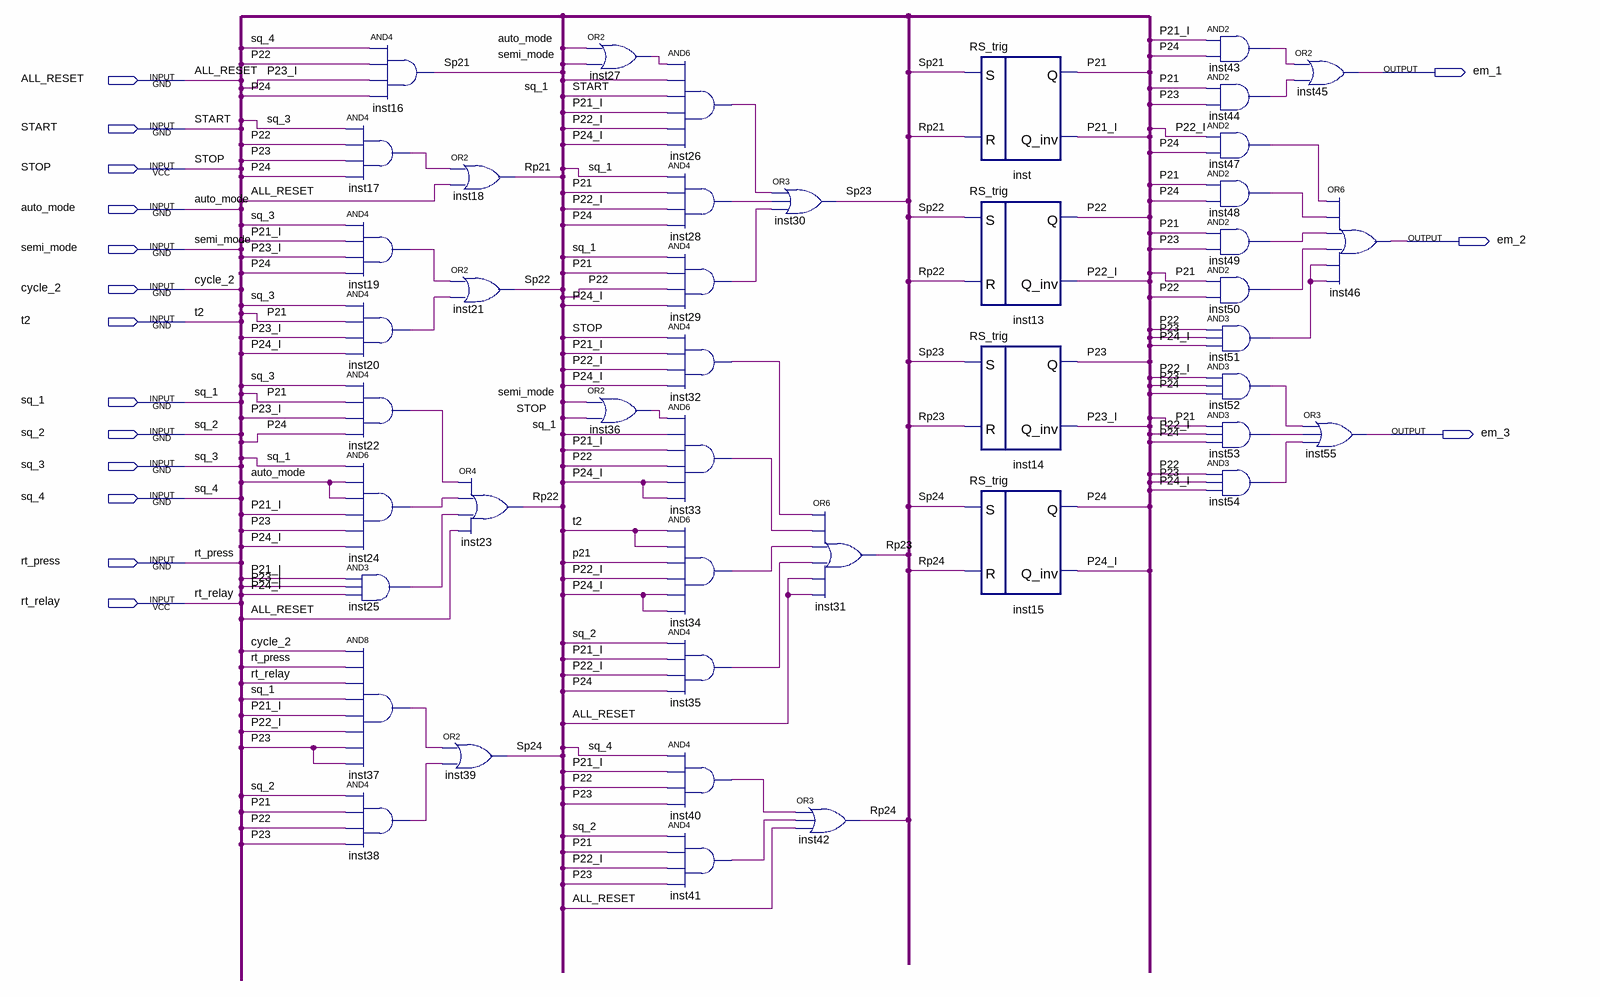
[diagram p0: schematic sheet]
// Quartus schematic cycle_2.bdf as structural Verilog: 44 symbols, 16 pins
module cycle_2 (
  input  ALL_RESET,
  input  START,
  input  STOP,
  input  auto_mode,
  input  semi_mode,
  input  cycle_2,
  input  t2,
  input  sq_1,
  input  sq_2,
  input  sq_3,
  input  sq_4,
  input  rt_press,
  input  rt_relay,
  output em_1,
  output em_2,
  output em_3
);

  wire inst17_out, inst19_out, inst20_out, inst22_out, inst24_out, inst25_out, inst26_out, inst27_out,
       inst28_out, inst29_out, inst32_out, inst33_out, inst34_out, inst35_out, inst36_out, inst37_out,
       inst38_out, inst40_out, inst41_out, inst43_out, inst44_out, inst47_out, inst48_out, inst49_out,
       inst50_out, inst51_out, inst52_out, inst53_out, inst54_out, P21, P21_I, P22, P22_I, P23, P23_I, P24,
       P24_I, Rp21, Rp22, Rp23, Rp24, Sp21, Sp22, Sp23, Sp24;

  and inst16 (Sp21, sq_4, P22, P23_I, P24);
  and inst17 (inst17_out, sq_3, P22, P23, P24);
  and inst19 (inst19_out, sq_3, P21_I, P23_I, P24);
  and inst20 (inst20_out, sq_3, P21, P23_I, P24_I);
  and inst22 (inst22_out, sq_3, P21, P23_I, P24);
  and inst24 (inst24_out, sq_1, auto_mode, auto_mode, P21_I, P23, P24_I);
  and inst25 (inst25_out, P21_I, P23_I, P24_I);
  and inst37 (inst37_out, cycle_2, rt_press, rt_relay, sq_1, P21_I, P22_I, P23, P23);
  and inst38 (inst38_out, sq_2, P21, P22, P23);
  or inst18 (Rp21, inst17_out, ALL_RESET);
  or inst21 (Sp22, inst19_out, inst20_out);
  or inst23 (Rp22, inst22_out, inst24_out, inst25_out, ALL_RESET);
  or inst39 (Sp24, inst37_out, inst38_out);
  or inst27 (inst27_out, auto_mode, semi_mode);
  or inst36 (inst36_out, semi_mode, STOP);
  and inst26 (inst26_out, inst27_out, sq_1, START, P21_I, P22_I, P24_I);
  and inst28 (inst28_out, sq_1, P21, P22_I, P24);
  and inst29 (inst29_out, sq_1, P21, P22, P24_I);
  and inst32 (inst32_out, STOP, P21_I, P22_I, P24_I);
  and inst33 (inst33_out, inst36_out, sq_1, P21_I, P22, P24_I, P24_I);
  and inst34 (inst34_out, t2, t2, P21, P22_I, P24_I, P24_I);
  and inst35 (inst35_out, sq_2, P21_I, P22_I, P24);
  and inst40 (inst40_out, sq_4, P21_I, P22, P23);
  and inst41 (inst41_out, sq_2, P21, P22_I, P23);
  or inst30 (Sp23, inst26_out, inst28_out, inst29_out);
  or inst31 (Rp23, inst32_out, inst33_out, inst34_out, inst35_out, ALL_RESET, ALL_RESET);
  or inst42 (Rp24, inst40_out, inst41_out, ALL_RESET);
  RS_trig inst (.S(Sp21), .R(Rp21), .Q(P21), .Q_inv(P21_I));
  RS_trig inst13 (.S(Sp22), .R(Rp22), .Q(P22), .Q_inv(P22_I));
  RS_trig inst14 (.S(Sp23), .R(Rp23), .Q(P23), .Q_inv(P23_I));
  RS_trig inst15 (.S(Sp24), .R(Rp24), .Q(P24), .Q_inv(P24_I));
  and inst43 (inst43_out, P21_I, P24);
  and inst44 (inst44_out, P21, P23);
  and inst47 (inst47_out, P22_I, P24);
  and inst48 (inst48_out, P21, P24);
  and inst49 (inst49_out, P21, P23);
  and inst50 (inst50_out, P21, P22);
  and inst51 (inst51_out, P22, P23, P24_I);
  and inst52 (inst52_out, P22_I, P23, P24);
  and inst53 (inst53_out, P21, P22_I, P24);
  and inst54 (inst54_out, P22, P23, P24_I);
  or inst45 (em_1, inst43_out, inst44_out);
  or inst55 (em_3, inst52_out, inst53_out, inst54_out);
  or inst46 (em_2, inst47_out, inst48_out, inst49_out, inst50_out, inst51_out, inst51_out);
endmodule
